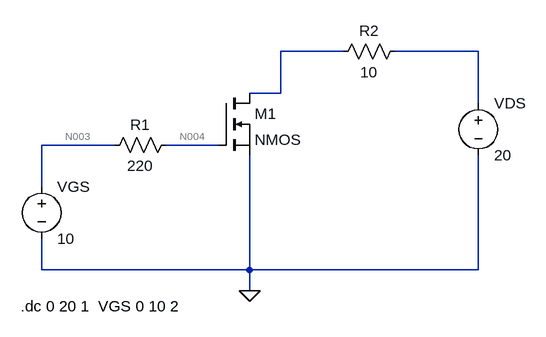
[diagram p0: schematic EEE_8.asc]
EEE_8.asc, the LTspice schematic file:
Version 4
SHEET 1 880 680
WIRE 416 -16 320 -16
WIRE 624 -16 496 -16
WIRE 320 48 320 -16
WIRE 320 48 272 48
WIRE 624 64 624 -16
WIRE 64 128 -48 128
WIRE 224 128 144 128
WIRE -48 192 -48 128
WIRE -48 320 -48 272
WIRE 272 320 272 144
WIRE 272 320 -48 320
WIRE 624 320 624 144
WIRE 624 320 272 320
WIRE 272 352 272 320
FLAG 272 352 0
SYMBOL nmos 224 48 R0
SYMATTR InstName M1
SYMBOL voltage -48 176 R0
SYMATTR InstName VGS
SYMATTR Value 10
SYMBOL res 160 112 R90
WINDOW 0 0 56 VBottom 2
WINDOW 3 32 56 VTop 2
SYMATTR InstName R1
SYMATTR Value 220
SYMBOL res 512 -32 R90
WINDOW 0 0 56 VBottom 2
WINDOW 3 32 56 VTop 2
SYMATTR InstName R2
SYMATTR Value 10
SYMBOL voltage 624 48 R0
SYMATTR InstName VDS
SYMATTR Value 20
TEXT -80 376 Left 2 !.dc 0 20 1  VGS 0 10 2

The netlist it stands for:
* EEE_8.asc
M1 N001 N004 0 0 NMOS
VGS N003 0 10
R1 N004 N003 220
R2 N002 N001 10
VDS N002 0 20
.model NMOS NMOS
.model PMOS PMOS
.lib standard.mos
.dc 0 20 1  VGS 0 10 2
.backanno
.end

* Results of the author's LTspice run, read from the files saved beside the schematic
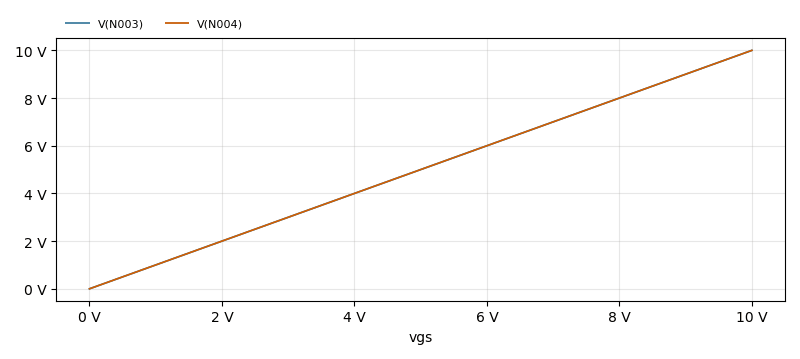
[diagram p1: DC transfer characteristic of EEE_8.asc, plotted from the saved traces]
* DC transfer characteristic, 1 run:
*   V(N003): 0 V at vgs=0 V, 10 V at vgs=10 V, min 0 V, max 10 V
*   V(N004): 0 V at vgs=0 V, 10 V at vgs=10 V, min 0 V, max 10 V